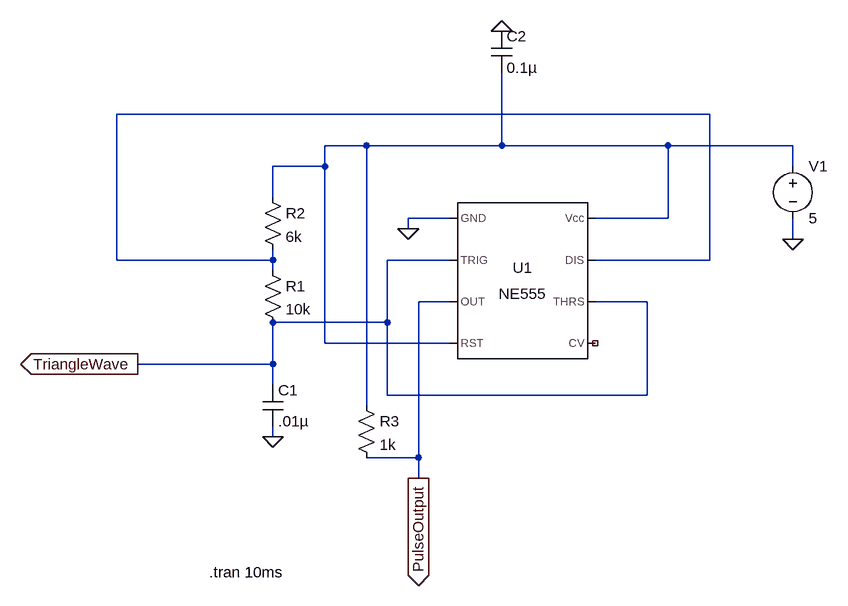
[diagram p0: schematic 555Timerdraft.asc]
555Timerdraft.asc, the LTspice schematic file:
Version 4
SHEET 1 880 700
WIRE 480 -64 -432 -64
WIRE -48 -16 -112 -16
WIRE 160 -16 160 -128
WIRE 160 -16 -48 -16
WIRE 416 -16 160 -16
WIRE 608 -16 416 -16
WIRE -112 16 -112 -16
WIRE -112 16 -192 16
WIRE 608 16 608 -16
WIRE -192 64 -192 16
WIRE 80 96 16 96
WIRE 416 96 416 -16
WIRE 416 96 304 96
WIRE 16 112 16 96
WIRE 608 128 608 96
WIRE -432 160 -432 -64
WIRE -192 160 -192 144
WIRE -192 160 -432 160
WIRE 80 160 -16 160
WIRE 480 160 480 -64
WIRE 480 160 304 160
WIRE -192 176 -192 160
WIRE 80 224 32 224
WIRE 384 224 304 224
WIRE -16 256 -16 160
WIRE -16 256 -192 256
WIRE -112 288 -112 16
WIRE 80 288 -112 288
WIRE -192 320 -192 256
WIRE -192 320 -400 320
WIRE -192 352 -192 320
WIRE -16 368 -16 256
WIRE 384 368 384 224
WIRE 384 368 -16 368
WIRE -48 384 -48 -16
WIRE -192 432 -192 416
WIRE 32 464 32 224
WIRE 32 464 -48 464
WIRE 32 496 32 464
FLAG 32 496 PulseOutput
IOPIN 32 496 Out
FLAG -192 432 0
FLAG 160 -192 0
FLAG 608 128 0
FLAG -400 320 TriangleWave
IOPIN -400 320 Out
FLAG 16 112 0
SYMBOL Misc\\NE555 192 192 R0
SYMATTR InstName U1
SYMBOL cap -208 352 R0
SYMATTR InstName C1
SYMATTR Value .01µ
SYMBOL res -208 160 R0
SYMATTR InstName R1
SYMATTR Value 10k
SYMBOL res -208 48 R0
SYMATTR InstName R2
SYMATTR Value 6k
SYMBOL cap 144 -192 R0
SYMATTR InstName C2
SYMATTR Value 0.1µ
SYMBOL res -64 368 R0
SYMATTR InstName R3
SYMATTR Value 1k
SYMBOL voltage 608 0 R0
WINDOW 123 0 0 Left 0
WINDOW 39 0 0 Left 0
SYMATTR InstName V1
SYMATTR Value 5
TEXT -290 640 Left 2 !.tran 10ms

The netlist it stands for:
* 555Timerdraft.asc
XU1 0 TriangleWave PulseOutput N002 NC_01 TriangleWave N001 N002 NE555  ; pins GND TRIG OUT RST CV THRS DIS Vcc
C1 TriangleWave 0 .01µ
R1 N001 TriangleWave 10k
R2 N002 N001 6k
C2 0 N002 0.1µ
R3 N002 PulseOutput 1k
V1 N002 0 5
.tran 10ms
.lib NE555.sub
.backanno
.end